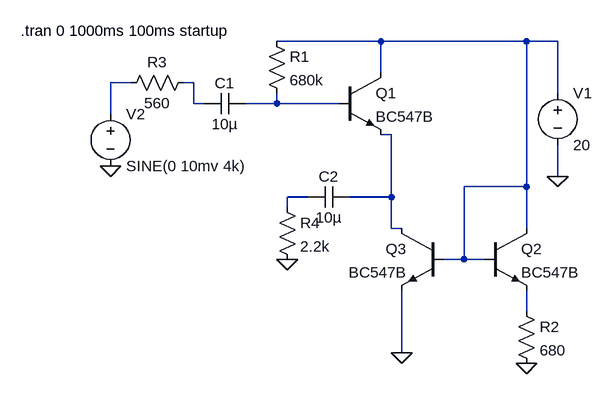
[diagram p0: schematic amp_final.asc]
amp_final.asc, the LTspice schematic file:
Version 4
SHEET 1 880 680
WIRE 160 0 0 0
WIRE 384 0 160 0
WIRE 432 0 384 0
WIRE 160 48 160 0
WIRE -224 64 -256 64
WIRE -128 64 -144 64
WIRE 432 80 432 0
WIRE -128 96 -128 64
WIRE -112 96 -128 96
WIRE 0 96 0 80
WIRE 0 96 -48 96
WIRE 96 96 0 96
WIRE -256 112 -256 64
WIRE 176 144 160 144
WIRE 432 208 432 160
WIRE 384 224 384 0
WIRE 384 224 288 224
WIRE 48 240 16 240
WIRE 176 240 176 144
WIRE 176 240 112 240
WIRE 16 256 16 240
WIRE 176 288 176 240
WIRE 192 288 176 288
WIRE 384 288 384 224
WIRE 288 336 288 224
WIRE 288 336 256 336
WIRE 320 336 288 336
WIRE 384 416 384 384
WIRE 192 480 192 384
FLAG 432 208 0
FLAG -256 192 0
FLAG 16 336 0
FLAG 384 496 0
FLAG 192 480 0
SYMBOL npn 96 48 R0
SYMATTR InstName Q1
SYMATTR Value BC547B
SYMBOL res -16 -16 R0
SYMATTR InstName R1
SYMATTR Value 680k
SYMBOL voltage 432 64 R0
WINDOW 123 0 0 Left 2
WINDOW 39 0 0 Left 2
SYMATTR InstName V1
SYMATTR Value 20
SYMBOL cap -48 80 R90
WINDOW 0 0 32 VBottom 2
WINDOW 3 32 32 VTop 2
SYMATTR InstName C1
SYMATTR Value 10µ
SYMBOL res -128 48 R90
WINDOW 0 0 56 VBottom 2
WINDOW 3 32 56 VTop 2
SYMATTR InstName R3
SYMATTR Value 560
SYMBOL res 0 240 R0
SYMATTR InstName R4
SYMATTR Value 2.2k
SYMBOL npn 320 288 R0
SYMATTR InstName Q2
SYMATTR Value BC547B
SYMBOL npn 256 288 M0
SYMATTR InstName Q3
SYMATTR Value BC547B
SYMBOL res 368 400 R0
SYMATTR InstName R2
SYMATTR Value 680
SYMBOL cap 112 224 R90
WINDOW 0 0 32 VBottom 2
WINDOW 3 32 32 VTop 2
SYMATTR InstName C2
SYMATTR Value 10µ
SYMBOL voltage -256 96 R0
WINDOW 123 0 0 Left 2
WINDOW 39 0 0 Left 2
SYMATTR InstName V2
SYMATTR Value SINE(0 10mv 4k)
TEXT -394 -16 Left 2 !.tran 0 1000ms 100ms startup

The netlist it stands for:
* amp_final.asc
Q1 N001 N004 N005 0 BC547B
R1 N001 N004 680k
V1 N001 0 20
C1 N004 N003 10µ
R3 N003 N002 560
R4 N006 0 2.2k
Q2 N001 N001 N007 0 BC547B
Q3 N005 N001 0 0 BC547B
R2 N007 0 680
C2 N005 N006 10µ
V2 N002 0 SINE(0 10mv 4k)
.model NPN NPN
.model PNP PNP
.lib standard.bjt
.tran 0 1000ms 100ms startup
.backanno
.end